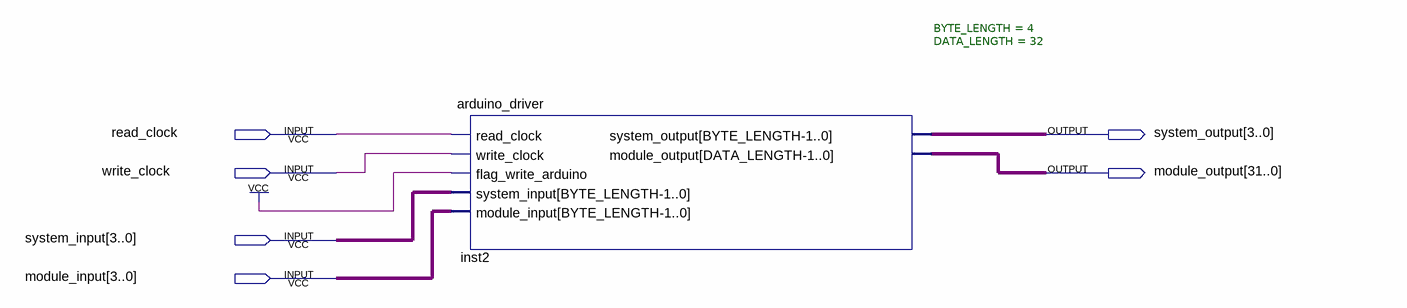
[diagram p0: schematic sheet]
// Quartus schematic arduino-driver.bdf as structural Verilog: 1 symbols, 6 pins
module \arduino-driver  (
  input  read_clock,
  input  write_clock,
  input  [3:0] system_input,
  input  [3:0] module_input,
  output [3:0] system_output,
  output [31:0] module_output
);

  arduino_driver #(.BYTE_LENGTH(4), .DATA_LENGTH(32)) inst2 (
    .read_clock(read_clock), .write_clock(write_clock), .flag_write_arduino(1'b1),
    .system_input(system_input), .module_input(module_input), .system_output(system_output),
    .module_output(module_output));
endmodule
